# EAGLE schematic Voltage1 (EAGLE 9.2.2)
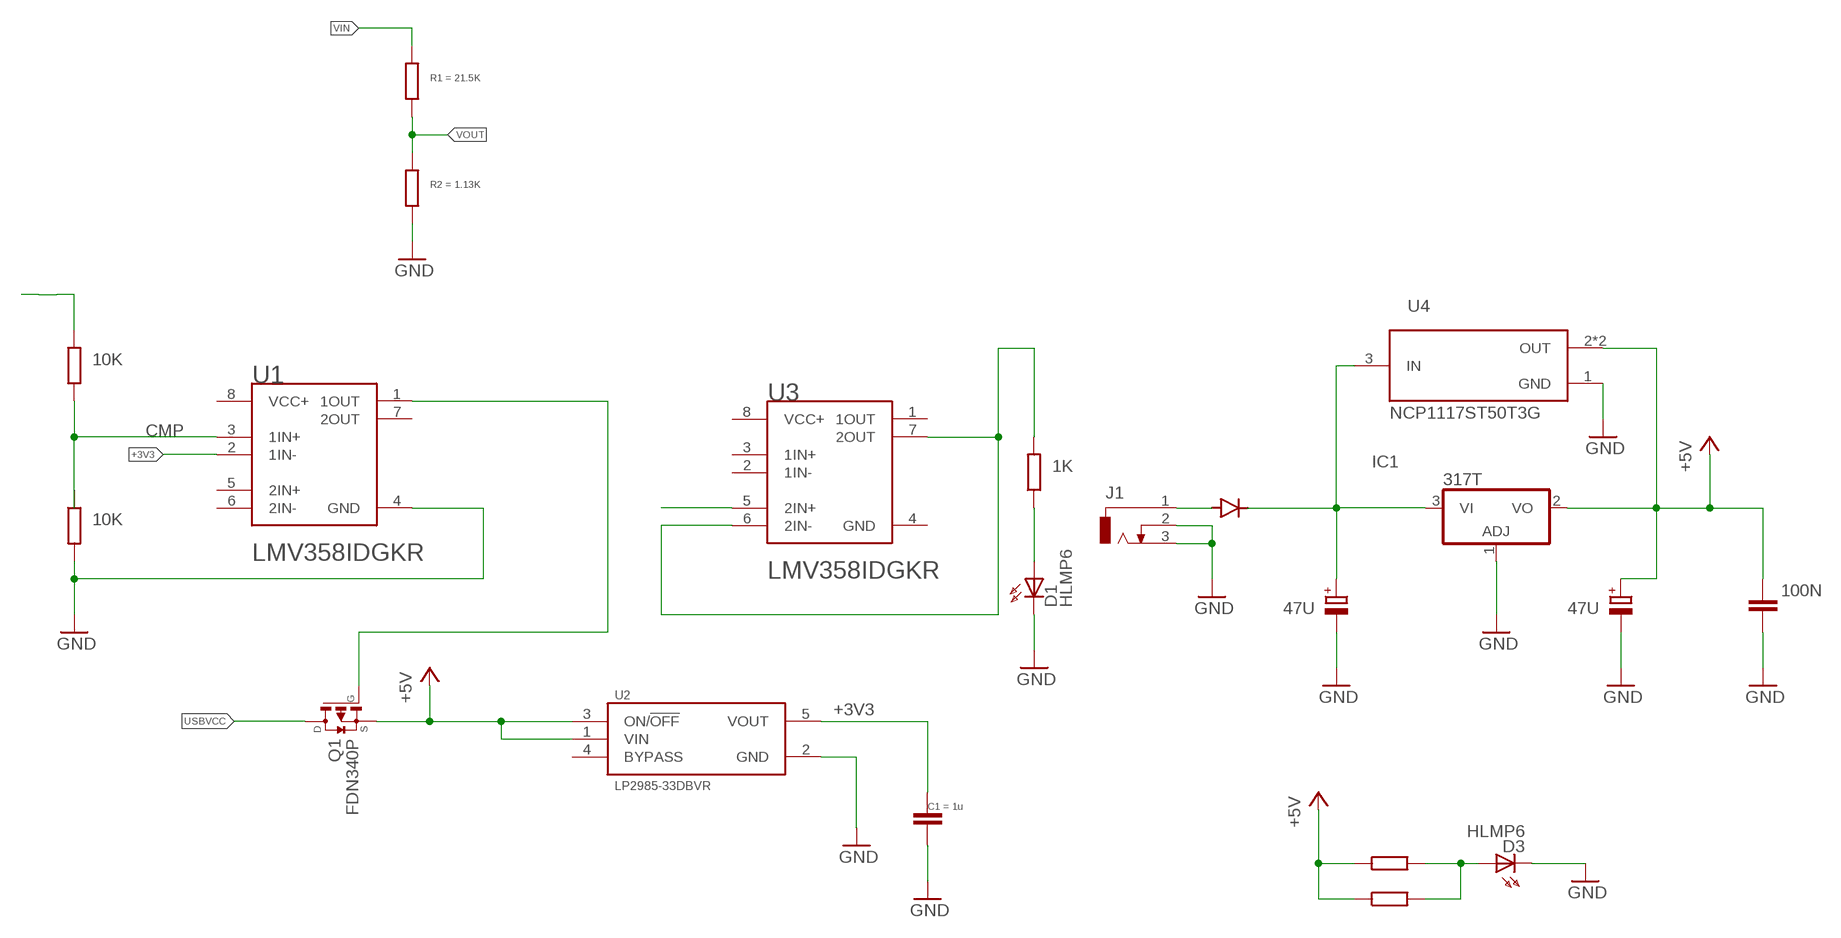
[diagram p0: schematic, sheet 1]
C1 (C): C1: 1u
R6 (R): R2: 1.13K
R7 (R): R1: 21.5K

## Parts
D1  HLMP6  [HLMP6]
D3  HLMP6  [HLMP6]
IC1  317T  [TO220H]
J1  DCJ0303  [DCJ0303]
Q1  FDN340P  [SSOT-3]
U1  TEXAS_INSTRUMENTS_LMV358IDGKRTEXAS_INSTRUMENTS_LMV358IDGKR_0_0  [TEXAS_INSTRUMENTS_LMV358IDGKR_0]
U2  LP2985-33DBVR  [SOT95P280X145-5N]
U3  TEXAS_INSTRUMENTS_LMV358IDGKRTEXAS_INSTRUMENTS_LMV358IDGKR_0_0  [TEXAS_INSTRUMENTS_LMV358IDGKR_0]
U4  NCP1117ST50T3G  [SOT230P700X180-4N]

## Nets
1K: U3.6(2IN-) U3.7(2OUT)
100N: IC1.2(VO) U4.2(OUT) U4.4(OUT) ; supply symbol labelled +5V
+3V3: U1.2(1IN-) U2.5(VOUT)
+5V: Q1.2(S) U2.1(VIN) U2.3(ON/!OFF)
CMP: U1.3(1IN+)
GND: D1.K D3.K IC1.1(ADJ) J1.2 J1.3 U1.4(GND) U2.2(GND) U4.1(GND)
N$1: D3.A
N$2: Q1.1(G) U1.1(1OUT)
N$3: J1.1
N$6: U3.5(2IN+)
N$9: D1.A
N$11: IC1.3(VI) U4.3(IN)
USBVCC: Q1.3(D)
Unconnected: U1.5(2IN+) U1.6(2IN-) U1.7(2OUT) U1.8(VCC+) U2.4(BYPASS) U3.1(1OUT) U3.2(1IN-) U3.3(1IN+) U3.4(GND) U3.8(VCC+)

## Library data of the parts
D1 D3 = display-hp:HLMP6: LED 2mm horizontal; MF: AGILENT TECHNOLOGIES; MPN: HLMP-6500; OC_FARNELL: 1652490; OC_NEWARK: 40K0088
IC1 = linear3:*317: Positive VOLTAGE REGULATOR
J1 = con-jack:DCJ0303: DC POWER JACK Source: DCJ0303.pdf; OC_FARNELL: unknown; OC_NEWARK: unknown
Q1 = FDN340P:FDN340P: P-Channel MOSFET Logic Level, PowerTrench MOSFET; AVAILABILITY: Unavailable; DESCRIPTION: FDN340P Series 20V 70 mOhm Single P-Ch Logic Level PowerTrench Mosfet SSOT-3; MF: MICROSS/On Semiconductor; MP: FDN340P; PACKAGE: SOT-23 Fairchild Semiconductor; PRICE: None
U1 U3 = Texas Instruments - LMV358IDGKR:TEXAS_INSTRUMENTS_LMV358IDGKR: Low-Voltage Rail-to-Rail Output Operational Amplifier; CENTROID_NOT_SPECIFIED: No; DATASHEET: http://www.ti.com/lit/ds/symlink/lmv324.pdf; DIGIKEY_DESCRIPTION: IC OPAMP GP 1MHZ RRO 8VSSOP; DIGIKEY_PART_NUMBER: 296-13455-1-ND; LEAD_FREE: yes; MF: Texas Instruments; MFG_PACKAGE_IDENT: DGK (S-PDSO-G8); MOUSER_PART_NUMBER: 595-LMV358IDGKR; MPN: LMV358IDGKR; PACKAGE: VSSOP8; PREFIX: U; ROHS: yes; TEMPERATURE_RANGE_HIGH: +125°C; TEMPERATURE_RANGE_LOW: -40°C; VOLTAGE: 5.5V
U2 = LP2985-33DBVR:LP2985-33DBVR: LP2985 150-mA Low-noise Low-dropout Regulator With Shutdown; AVAILABILITY: Unavailable; DESCRIPTION: Single Output LDO, 150mA, Fixed_3.3V_, 1.5% Tolerance, Low Quiescent Current, Low Noise 5-SOT-23 -40 to 125; MF: Texas Instruments; MP: LP2985-33DBVR; PACKAGE: SOT-23-5 Texas Instruments; PRICE: None
U4 = NCP1117ST50T3G:NCP1117ST50T3G: 1.0 A Low-Dropout Positive ,Fixed and Adjustable,Voltage Regulators; AVAILABILITY: Unavailable; MF: ON Semiconductor; MP: NCP1117ST50T3G; PACKAGE: TO-261-4 HTC Korea; PRICE: None